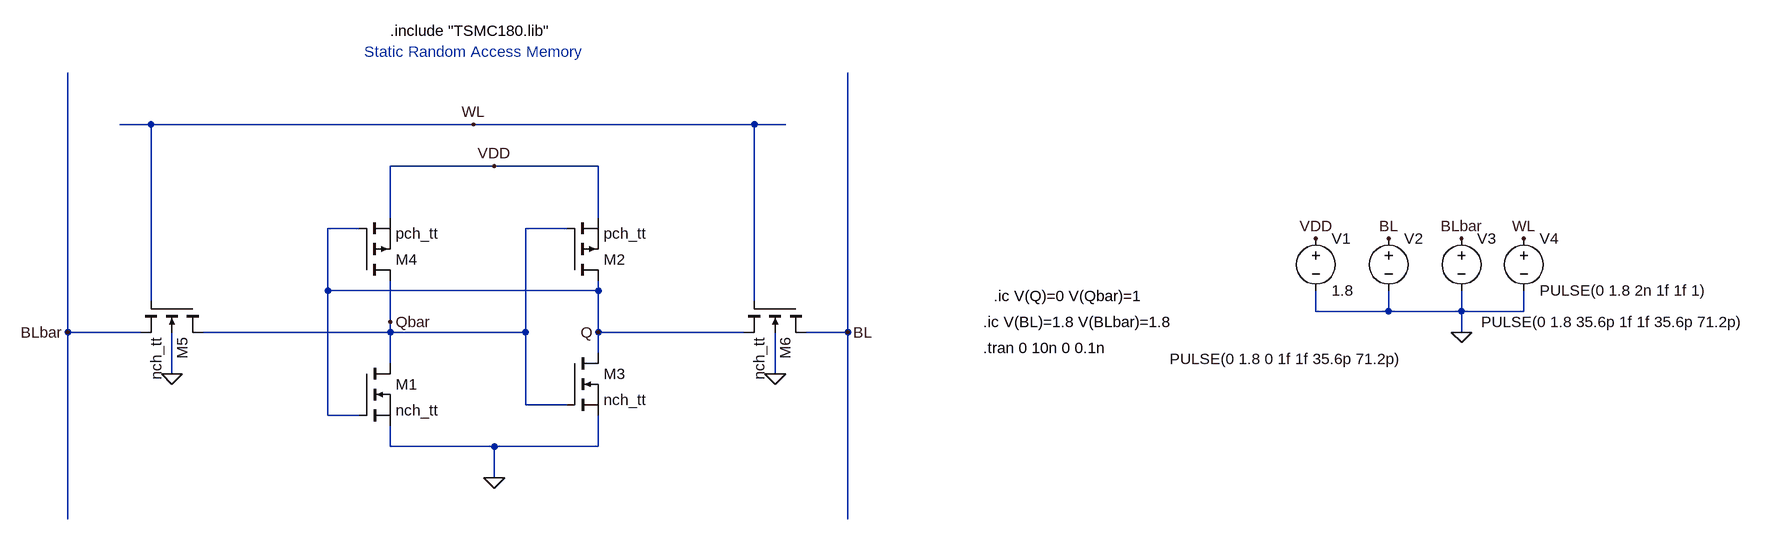
[diagram p0: schematic qu1.asc]
qu1.asc, the LTspice schematic file:
Version 4
SHEET 1 2412 1144
WIRE -304 192 -352 192
WIRE 192 192 -304 192
WIRE 624 192 192 192
WIRE 672 192 624 192
WIRE 224 256 64 256
WIRE 384 256 224 256
WIRE 64 336 64 256
WIRE 384 336 384 256
WIRE 16 352 -32 352
WIRE 336 352 272 352
WIRE -32 448 -32 352
WIRE 384 448 384 432
WIRE 384 448 -32 448
WIRE -304 464 -304 192
WIRE 624 464 624 192
WIRE 1488 480 1488 448
WIRE 1600 480 1600 448
WIRE 1600 480 1488 480
WIRE 1712 480 1712 448
WIRE 1712 480 1600 480
WIRE 1808 480 1808 448
WIRE 1808 480 1712 480
WIRE 64 496 64 432
WIRE -432 512 -432 112
WIRE -320 512 -432 512
WIRE 64 512 64 496
WIRE 64 512 -224 512
WIRE 272 512 272 352
WIRE 272 512 64 512
WIRE 384 512 384 448
WIRE 608 512 384 512
WIRE 768 512 768 112
WIRE 768 512 704 512
WIRE 1712 512 1712 480
WIRE 384 544 384 512
WIRE 64 560 64 512
WIRE -272 576 -272 512
WIRE 656 576 656 512
WIRE 272 624 272 512
WIRE 336 624 272 624
WIRE -32 640 -32 448
WIRE 16 640 -32 640
WIRE 64 688 64 656
WIRE 224 688 64 688
WIRE 384 688 384 640
WIRE 384 688 224 688
WIRE 224 736 224 688
WIRE -432 800 -432 512
WIRE 768 800 768 512
FLAG 224 736 0
FLAG 224 256 VDD
FLAG 1488 368 VDD
FLAG 1712 512 0
FLAG 1600 368 BL
FLAG 1712 368 BLbar
FLAG 1808 368 WL
FLAG -432 512 BLbar
FLAG 192 192 WL
FLAG 384 512 Q
FLAG 64 496 Qbar
FLAG 656 576 0
FLAG -272 576 0
FLAG 768 512 BL
SYMBOL nmos 16 560 R0
SYMATTR InstName M1
SYMATTR Value nch_tt
SYMATTR Value2 W=720nm  L=180nm
SYMBOL nmos 336 544 R0
SYMATTR InstName M3
SYMATTR Value nch_tt
SYMATTR Value2 W=720nm  L=180nm
SYMBOL voltage 1488 352 R0
WINDOW 123 0 0 Left 0
WINDOW 39 0 0 Left 0
SYMATTR InstName V1
SYMATTR Value 1.8
SYMBOL voltage 1600 352 R0
WINDOW 123 -337 229 Left 2
WINDOW 3 -337 201 Left 2
WINDOW 39 0 0 Left 0
SYMATTR Value PULSE(0 1.8 0 1f 1f 35.6p 71.2p)
SYMATTR InstName V2
SYMBOL voltage 1712 352 R0
WINDOW 123 0 0 Left 0
WINDOW 39 0 0 Left 0
WINDOW 3 30 144 Left 2
SYMATTR Value PULSE(0 1.8 35.6p 1f 1f 35.6p 71.2p)
SYMATTR InstName V3
SYMBOL voltage 1808 352 R0
WINDOW 123 0 0 Left 0
WINDOW 39 0 0 Left 0
SYMATTR InstName V4
SYMATTR Value PULSE(0 1.8 2n 1f 1f 1)
SYMBOL pmos 336 432 M180
SYMATTR InstName M2
SYMATTR Value pch_tt
SYMATTR Value2 W=270nm L=270nm
SYMBOL pmos 16 432 M180
SYMATTR InstName M4
SYMATTR Value pch_tt
SYMATTR Value2 W=270nm L=270nm
SYMBOL nmos4 704 464 R90
SYMATTR InstName M6
SYMATTR Value nch_tt
SYMATTR Value2 W=360nm L=180nm
SYMBOL nmos4 -224 464 R90
SYMATTR InstName M5
SYMATTR Value nch_tt
SYMATTR Value2 W=360nm L=180nm
TEXT 64 48 Left 2 !.include "TSMC180.lib"
TEXT 24 80 Left 2 ;Static Random Access Memory
TEXT 976 536 Left 2 !.tran 0 10n 0 0.1n
TEXT 976 496 Left 2 !.ic V(BL)=1.8 V(BLbar)=1.8
TEXT 992 456 Left 2 !.ic V(Q)=0 V(Qbar)=1

The netlist it stands for:
* qu1.asc
M1 Qbar Q 0 0 nch_tt W=720nm  L=180nm
M3 Q Qbar 0 0 nch_tt W=720nm  L=180nm
V1 VDD 0 1.8
V2 BL 0 PULSE(0 1.8 0 1f 1f 35.6p 71.2p)
V3 BLbar 0 PULSE(0 1.8 35.6p 1f 1f 35.6p 71.2p)
V4 WL 0 PULSE(0 1.8 2n 1f 1f 1)
M2 Q Qbar VDD VDD pch_tt W=270nm L=270nm
M4 Qbar Q VDD VDD pch_tt W=270nm L=270nm
M6 BL WL Q 0 nch_tt W=360nm L=180nm
M5 Qbar WL BLbar 0 nch_tt W=360nm L=180nm
.model NMOS NMOS
.model PMOS PMOS
.lib standard.mos
.include "TSMC180.lib"
* Static Random Access Memory
.tran 0 10n 0 0.1n
.ic V(BL)=1.8 V(BLbar)=1.8
.ic V(Q)=0 V(Qbar)=1
.backanno
.end